# Altium schematic sheet 16gpio_misc.SchDoc
size B
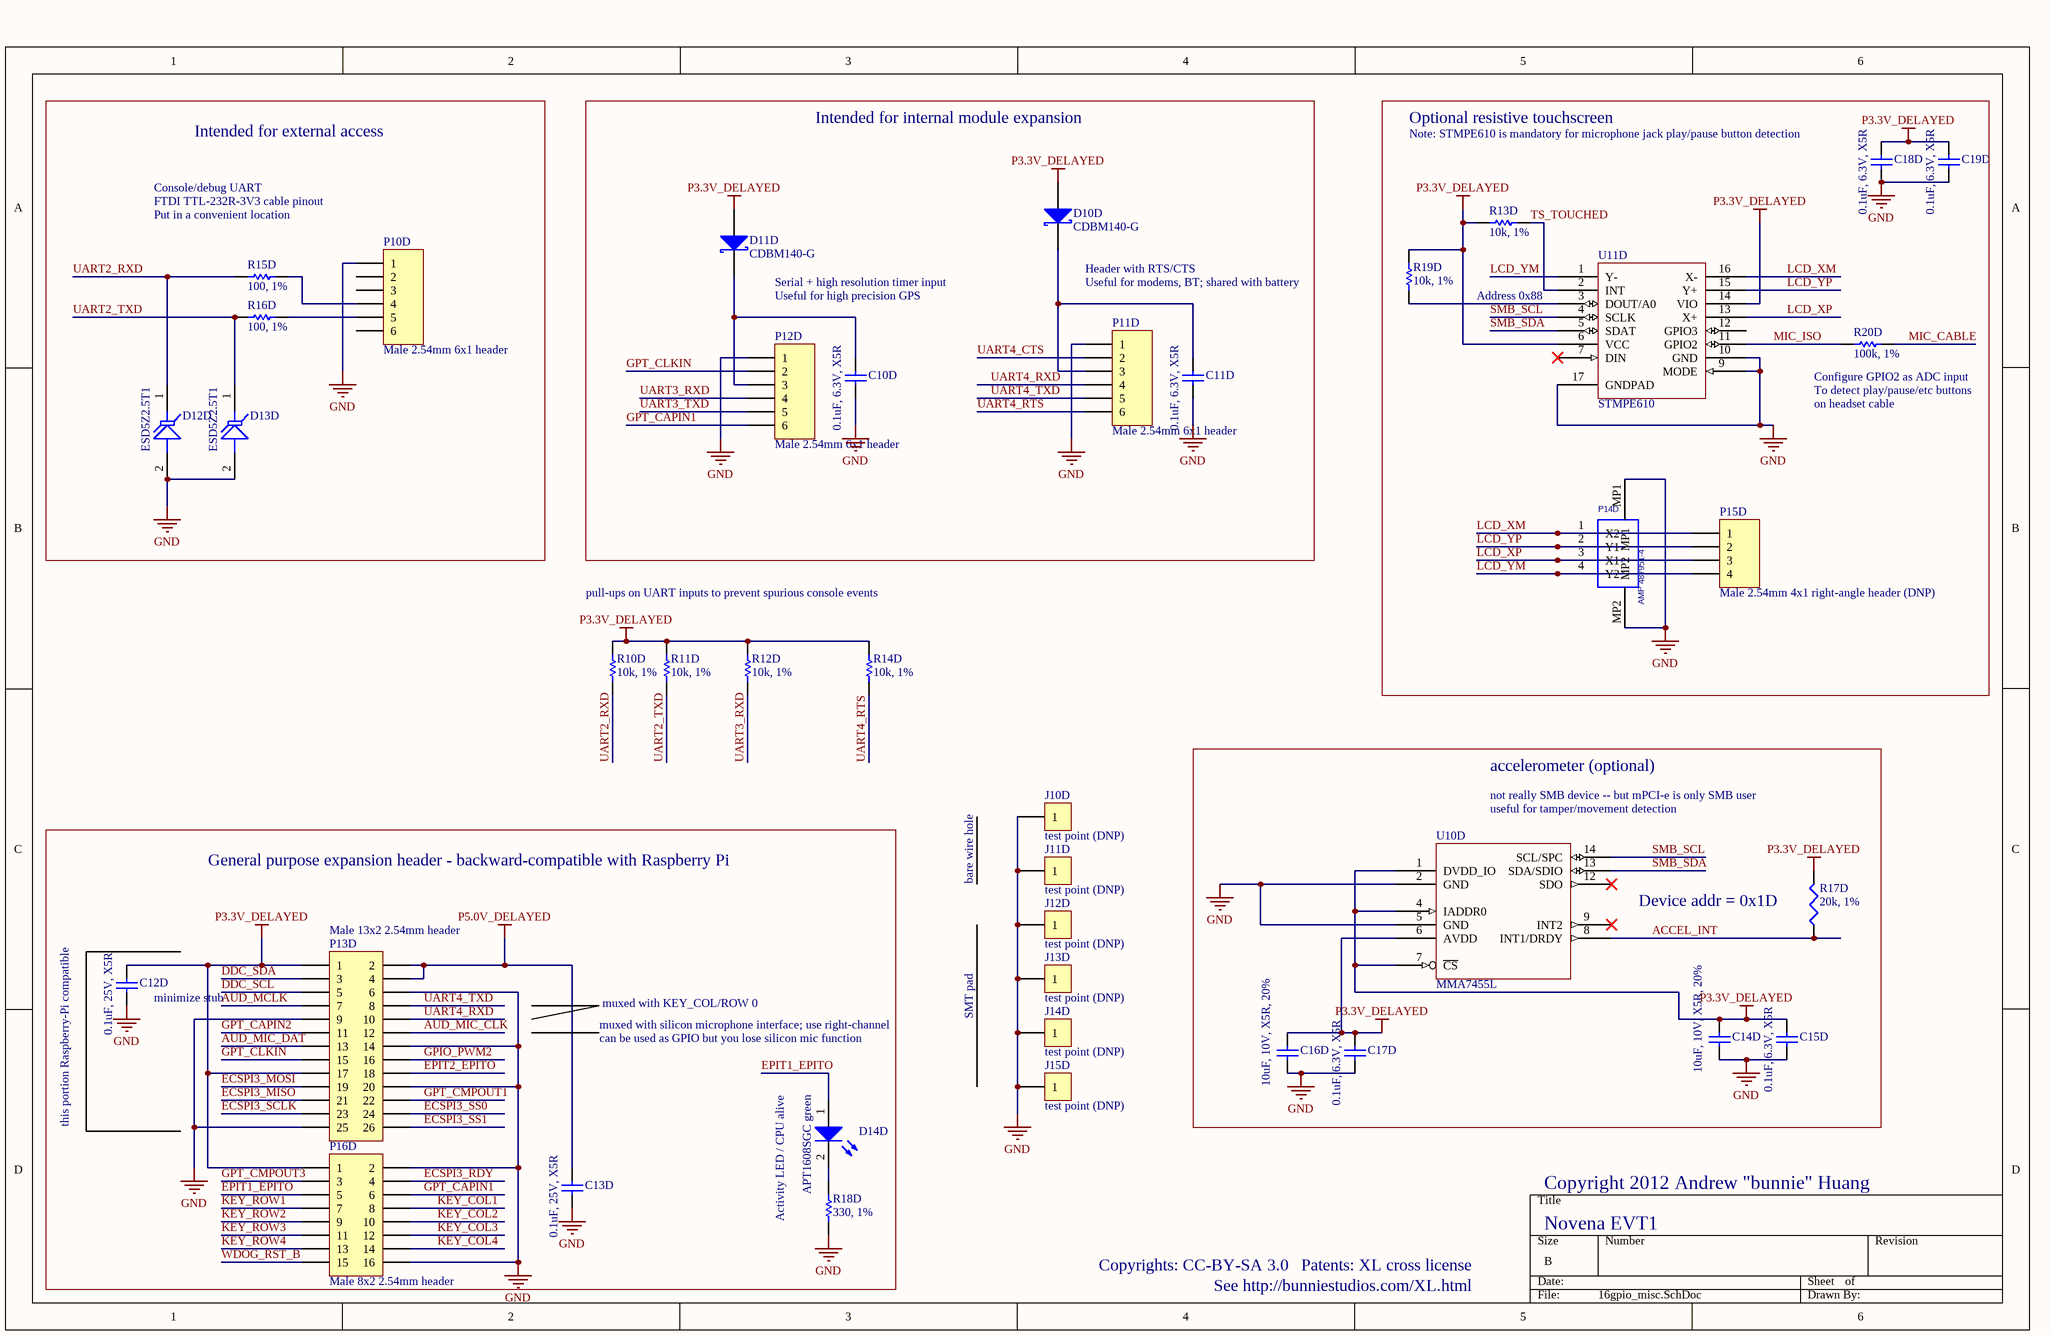
[diagram p0: 16gpio_misc.SchDoc]

## Parts
C10D  0.1uF, 6.3V, X5R  [CAPC0603N_B]
C11D  0.1uF, 6.3V, X5R  [CAPC0603N_B]
C12D  0.1uF, 25V, X5R  [CAPC1005N]
C13D  0.1uF, 25V, X5R  [CAPC1005N]
C14D  10uF, 10V, X5R, 20%  [CAPC1608N]
C15D  0.1uF, 6.3V, X5R  [CAPC0603N_B]
C16D  10uF, 10V, X5R, 20%  [CAPC1608N]
C17D  0.1uF, 6.3V, X5R  [CAPC0603N_B]
C18D  0.1uF, 6.3V, X5R  [CAPC0603N_B]
C19D  0.1uF, 6.3V, X5R  [CAPC0603N_B]
D10D  CDBM140-G  [SOD123]
D11D  CDBM140-G  [SOD123]
D12D  ESD5Z2.5T1  [SOD-523]
D13D  ESD5Z2.5T1  [SOD-523]
D14D  APT1608SGC green  [CD1608-0603]
J10D  test point (DNP)  [TP_HOLE]
J11D  test point (DNP)  [TP_HOLE]
J12D  test point (DNP)  [TP_SMT_38mil]
J13D  test point (DNP)  [TP_SMT_38mil]
J14D  test point (DNP)  [TP_SMT_38mil]
J15D  test point (DNP)  [TP_SMT_38mil]
P10D  Male 2.54mm 6x1 header  [HDR1X6]
P11D  Male 2.54mm 6x1 header  [HDR1X6]
P12D  Male 2.54mm 6x1 header  [HDR1X6]
P13D  Male 13x2 2.54mm header  [HDR2X13]
P14D  AMP 487951-4  [AMP_487951_4]
P15D  Male 2.54mm 4x1 right-angle header (DNP)  [HDR1X4H]
P16D  Male 8x2 2.54mm header  [HDR2X8]
R10D  10k, 1%  [RESC1005N]
R11D  10k, 1%  [RESC1005N]
R12D  10k, 1%  [RESC1005N]
R13D  10k, 1%  [RESC1005N]
R14D  10k, 1%  [RESC1005N]
R15D  100, 1%  [RESC1005N]
R16D  100, 1%  [RESC1005N]
R17D  20k, 1%  [RESC1005N]
R18D  330, 1%  [RESC1005N]
R19D  10k, 1%  [RESC1005N]
R20D  100k, 1%  [RESC1005N]
U10D  MMA7455L  [FREESCALE_LGA14_3mm_5mm]
U11D  STMPE610  [QFN50P300X300-16V2N]

## Blocks framed on the sheet
Intended for external access: D12D D13D P10D R15D R16D
Intended for internal module expansion: C10D C11D D10D D11D P11D P12D
Optional resistive touchscreen: C18D C19D P14D P15D R13D R19D R20D U11D

## Nets
GND: C10D.2 C11D.2 C12D.2 C13D.2 C14D.2 C15D.2 C16D.2 C17D.2 C18D.2 C19D.2 D12D.2(A) D13D.2(A) J10D.1 J11D.1 J12D.1 J13D.1 J14D.1 J15D.1 P10D.1 P11D.1 P12D.1 P13D.6 P13D.9 P13D.14 P13D.20 P13D.25 P14D.MP1 P14D.MP2 P16D.2 P16D.16 R18D.1 U10D.2(GND) U10D.5(GND) U11D.9(MODE) U11D.10(GND) U11D.17(GNDPAD)
P3.3V_DELAYED: C12D.1 C14D.1 C15D.1 C16D.1 C17D.1 C18D.1 C19D.1 D10D.1(A) D11D.1(A) P13D.1 P13D.17 P16D.1 R10D.1 R11D.1 R12D.1 R13D.2 R14D.1 R17D.2 R19D.1 U10D.1(DVDD_IO) U10D.4(IADDR0) U10D.6(AVDD) U10D.7(~{CS}) U11D.6(VCC) U11D.14(VIO)
P5.0V_DELAYED: C13D.1 P13D.2 P13D.4
ACCEL_INT: R17D.1 U10D.8(INT1/DRDY)
AUD_MCLK: P13D.7
AUD_MIC_CLK: P13D.12
AUD_MIC_DAT: P13D.13
DDC_SCL: P13D.5
DDC_SDA: P13D.3
ECSPI3_MISO: P13D.21
ECSPI3_MOSI: P13D.19
ECSPI3_RDY: P16D.4
ECSPI3_SCLK: P13D.23
ECSPI3_SS0: P13D.24
ECSPI3_SS1: P13D.26
EPIT1_EPITO: D14D.1(A) P16D.5
EPIT2_EPITO: P13D.18
GPIO_PWM2: P13D.16
GPT_CAPIN1: P12D.6 P16D.6
GPT_CAPIN2: P13D.11
GPT_CLKIN: P12D.2 P13D.15
GPT_CMPOUT1: P13D.22
GPT_CMPOUT3: P16D.3
KEY_COL1: P16D.8
KEY_COL2: P16D.10
KEY_COL3: P16D.12
KEY_COL4: P16D.14
KEY_ROW1: P16D.7
KEY_ROW2: P16D.9
KEY_ROW3: P16D.11
KEY_ROW4: P16D.13
LCD_XM: P14D.1(X2) P15D.1 U11D.16(X-)
LCD_XP: P14D.3(X1) P15D.3 U11D.13(X+)
LCD_YM: P14D.4(Y2) P15D.4 U11D.1(Y-)
LCD_YP: P14D.2(Y1) P15D.2 U11D.15(Y+)
MIC_CABLE: R20D.2
MIC_ISO: R20D.1 U11D.11(GPIO2)
SMB_SCL: U10D.14(SCL/SPC) U11D.4(SCLK)
SMB_SDA: U10D.13(SDA/SDIO) U11D.5(SDAT)
TS_TOUCHED: R13D.1 U11D.2(INT)
UART2_RXD: D12D.1(K) R10D.2 R15D.2
UART2_TXD: D13D.1(K) R11D.2 R16D.2
UART3_RXD: P12D.4 R12D.2
UART3_TXD: P12D.5
UART4_CTS: P11D.2
UART4_RTS: P11D.6 R14D.2
UART4_RXD: P11D.4 P13D.10
UART4_TXD: P11D.5 P13D.8
WDOG_RST_B: P16D.15
NetC10D_1: C10D.1 D11D.2(K) P12D.3
NetC11D_1: C11D.1 D10D.2(K) P11D.3
NetD14D_2: D14D.2(K) R18D.2
NetP10D_4: P10D.4 R15D.1
NetP10D_5: P10D.5 R16D.1
NetR19D_2: R19D.2 U11D.3(DOUT/A0)

Not connected (* = marked no-connect by the designer): P10D 2 3 6; U10D 9(INT2)* 12(SDO)*; U11D 7(DIN)* 12(GPIO3)

## Notes on the sheet
- (near C18D) Note: STMPE610 is mandatory for microphone jack play/pause button detection
- FTDI TTL-232R-3V3 cable pinout
- Console/debug UART
- Put in a convenient location
- Header with RTS/CTS
- Serial + high resolution timer input
- Useful for high precision GPS
- Useful for modems, BT; shared with battery
- Address 0x88
- (near R20D) Configure GPIO2 as ADC input
- (near R20D) To detect play/pause/etc buttons
- on headset cable
- pull-ups on UART inputs to prevent spurious console events
- not really SMB device -- but mPCI-e is only SMB user
- (near U10D) useful for tamper/movement detection
- accelerometer (optional)
- General purpose expansion header - backward-compatible with Raspberry Pi
- bare wire hole
- (near R17D) Device addr = 0x1D
- (near C12D) minimize stub
- muxed with KEY_COL/ROW 0
- SMT pad
- muxed with silicon microphone interface; use right-channel
- can be used as GPIO but you lose silicon mic function
- this portion Raspberry-Pi compatible
- Activity LED / CPU alive
- Copyright 2012 Andrew "bunnie" Huang
- Copyrights: CC-BY-SA 3.0
- Patents: XL cross license
- Novena EVT1
- See http://bunniestudios.com/XL.html

## Library data of the parts
C10D C11D C12D C13D C14D C15D C16D C17D C18D C19D = Cap Semi: Capacitor (Semiconductor SIM Model); Published: 8-Jun-2000; LatestRevisionDate: 17-Jul-2002; LatestRevisionNote: Re-released for DXP Platform.; PackageReference: C1206; Publisher: Altium Limited
D10D D11D = D Schottky: Schottky Diode; Code - JEDEC: DO-214-AA; Published: 8-Jun-2000; Publisher: Altium Limited; Revision: July-2002: Re-released for DXP Platform.
D12D D13D = Tranzorb: On Semi 3.3V standoff TVS diode; Published: 24-Mar-1999; LatestRevisionDate: 17-Jul-2002; LatestRevisionNote: Re-released for DXP Platform.; PackageReference: DO-7; Publisher: Altium Limited
D14D = LED2: Typical RED, GREEN, YELLOW, AMBER GaAs LED; Published: 8-Jun-2000; LatestRevisionDate: 17-Jul-2002; LatestRevisionNote: Re-released for DXP Platform.; PackageVersion: Feb-2002; PackageReference: 3.2X1.6X1.1; Publisher: Altium Limited
J10D J11D J12D J13D J14D J15D = CON1: Connector
P10D P11D P12D = Header 6: Header, 6-Pin; LatestRevisionDate: 17-Jul-2002; LatestRevisionNote: Re-released for DXP Platform.; Publisher: Altium Limited
P13D = Header 13X2: Header, 13-Pin, Dual row; LatestRevisionDate: 17-Jul-2002; LatestRevisionNote: Re-released for DXP Platform.; Publisher: Altium Limited
P14D = TFT_TP_CON: Right: 30; Bottom: 50
P15D = Header 4H: Header, 4-Pin, Right Angle; LatestRevisionDate: 17-Jul-2002; LatestRevisionNote: Re-released for DXP Platform.; Publisher: Altium Limited
P16D = Header 8X2: Header, 8-Pin, Dual row; LatestRevisionDate: 17-Jul-2002; LatestRevisionNote: Re-released for DXP Platform.; Publisher: Altium Limited
R10D R11D R12D R13D R14D R15D R16D R18D R19D = Res1: Resistor; Value: 100k; Published: 8-Jun-2000; LatestRevisionDate: 17-Jul-2002; LatestRevisionNote: Re-released for DXP Platform.; PackageReference: AXIAL-0.3; Publisher: Altium Limited
R17D = Res3: Resistor; Published: 8-Jun-2000; LatestRevisionDate: 4-Mar-2005; LatestRevisionNote: PCB Footprint replaced.; Publisher: Altium Limited
R20D = Res1: Resistor; Published: 8-Jun-2000; LatestRevisionDate: 17-Jul-2002; LatestRevisionNote: Re-released for DXP Platform.; PackageReference: AXIAL-0.3; Publisher: Altium Limited; Value: 100k
U10D = FREESCALE_MMA7455L: 3-axis accelerometer, 10 bit, selectable g-range
U11D = STMPE610: 4-wire resistive touchscreen controller